# Altium schematic sheet FiltroRecuperador.SchDoc
size A4
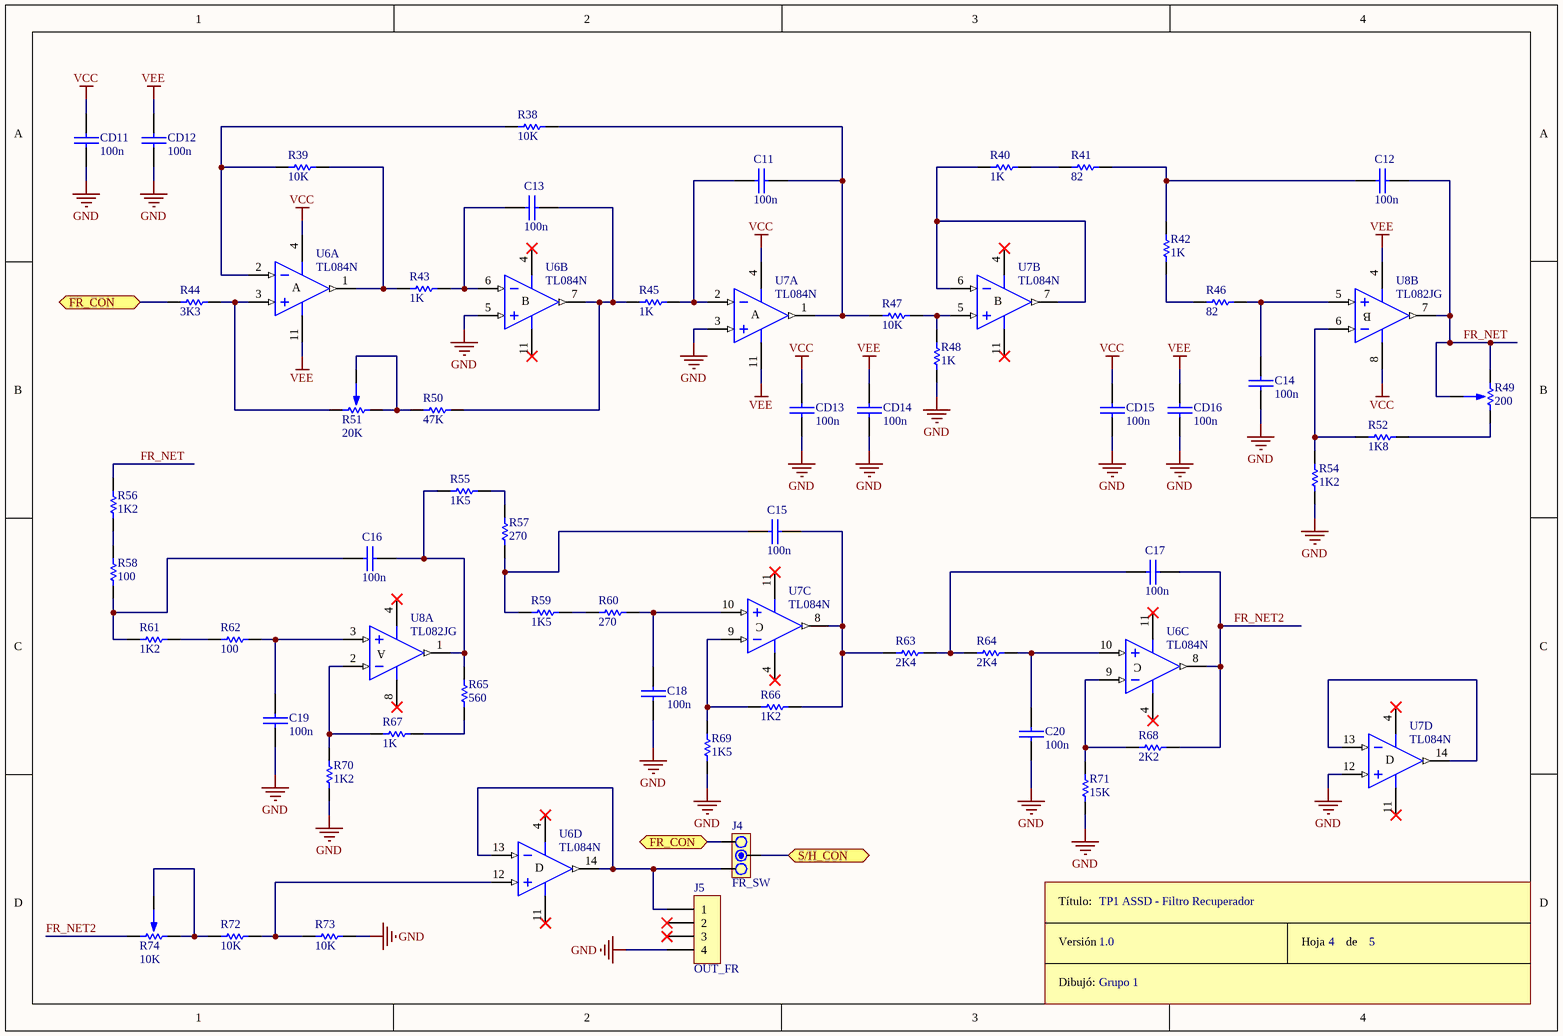
[diagram p0: FiltroRecuperador.SchDoc]

## Parts
C11  100n  [CAP100]
C12  100n  [CAP100]
C13  100n  [CAP100]
C14  100n  [CAP100]
C15  100n  [CAP100]
C16  100n  [CAP100]
C17  100n  [CAP100]
C18  100n  [CAP100]
C19  100n  [CAP100]
C20  100n  [CAP100]
CD11  100n  [CAP100]
CD12  100n  [CAP100]
CD13  100n  [CAP100]
CD14  100n  [CAP100]
CD15  100n  [CAP100]
CD16  100n  [CAP100]
J4  FR_SW  [JUMPER3]
J5  OUT_FR  [SIP4]
R38  10K  [RES400]
R39  10K  [RES400]
R40  1K  [RES400]
R41  82  [RES400]
R42  1K  [RES400]
R43  1K  [RES400]
R44  3K3  [RES400]
R45  1K  [RES400]
R46  82  [RES400]
R47  10K  [RES400]
R48  1K  [RES400]
R49  200  [PRESET V]
R50  47K  [RES400]
R51  20K  [PRESET V]
R52  1K8  [RES400]
R54  1K2  [RES400]
R55  1K5  [RES400]
R56  1K2  [RES400]
R57  270  [RES400]
R58  100  [RES400]
R59  1K5  [RES400]
R60  270  [RES400]
R61  1K2  [RES400]
R62  100  [RES400]
R63  2K4  [RES400]
R64  2K4  [RES400]
R65  560  [RES400]
R66  1K2  [RES400]
R67  1K  [RES400]
R68  2K2  [RES400]
R69  1K5  [RES400]
R70  1K2  [RES400]
R71  15K  [RES400]
R72  10K  [RES400]
R73  10K  [RES400]
R74  10K  [PRESET V]
ROT4  Rótulo  (value not drawn)
U6  TL084N  [N014]  (parts A,B,C,D of 4)
U7  TL084N  [N014]  (parts A,B,C,D of 4)
U8  TL082JG  [JG008]  (parts A,B of 2)

## Ports
FR_CON, S/H_CON

## Nets
GND: C14.2 C18.2 C19.1 C20.2 CD11.2 CD12.2 CD13.2 CD14.2 CD15.2 CD16.2 J5.4 R48.1 R54.1 R69.1 R70.1 R71.1 R73.1 U6.5(IN+) U7.3(IN+) U7.12(IN+)
VCC: CD11.1 CD13.1 CD15.1 U6.4(V+) U7.4(V+) U8.8(V+)
VEE: CD12.1 CD14.1 CD16.1 U6.11(V-) U7.11(V-) U8.4(V-)
FR_CON: J4.3 R44.1 ; port FR_CON
FR_NET: C12.2 R49.2 R49.3 R56.1 U8.7(OUT)
FR_NET2: C17.2 R68.2 R74.1 U6.8(OUT)
S/H_CON: J4.2 ; port S/H_CON
NetC11_1: C11.1 R45.2 U7.2(IN-)
NetC11_2: C11.2 R38.2 R47.1 U7.1(OUT)
NetC12_1: C12.1 R41.2 R42.2
NetC13_1: C13.1 R43.2 U6.6(IN-)
NetC13_2: C13.2 R45.1 R50.2 U6.7(OUT)
NetC14_1: C14.1 R46.2 U8.5(IN+)
NetC15_1: C15.1 R57.2 R59.1
NetC15_2: C15.2 R63.1 R66.2 U7.8(OUT)
NetC16_1: C16.1 R58.2 R61.1
NetC16_2: C16.2 R55.2 R65.2 U8.1(OUT)
NetC17_1: C17.1 R63.2 R64.1
NetC18_1: C18.1 R60.2 U7.10(IN+)
NetC19_2: C19.2 R62.2 U8.3(IN+)
NetC20_1: C20.1 R64.2 U6.10(IN+)
NetJ4_1: J4.1 J5.1 U6.13(IN-) U6.14(OUT)
NetR38_1: R38.1 R39.1 U6.2(IN-)
NetR39_2: R39.2 R43.1 U6.1(OUT)
NetR40_1: R40.1 R41.1
NetR40_2: R40.2 U7.6(IN-) U7.7(OUT)
NetR42_1: R42.1 R46.1
NetR44_2: R44.2 R51.1 U6.3(IN+)
NetR47_2: R47.2 R48.2 U7.5(IN+)
NetR49_1: R49.1 R52.2
NetR50_1: R50.1 R51.2 R51.3
NetR52_1: R52.1 R54.2 U8.6(IN-)
NetR55_1: R55.1 R57.1
NetR56_2: R56.2 R58.1
NetR59_2: R59.2 R60.1
NetR61_2: R61.2 R62.1
NetR65_1: R65.1 R67.2
NetR66_1: R66.1 R69.2 U7.9(IN-)
NetR67_1: R67.1 R70.2 U8.2(IN-)
NetR68_1: R68.1 R71.2 U6.9(IN-)
NetR72_1: R72.1 R74.2 R74.3
NetR72_2: R72.2 R73.2 U6.12(IN+)
NetU7_13: U7.13(IN-) U7.14(OUT)

Not connected (* = marked no-connect by the designer): J5 2* 3*

## Notes on the sheet
- TP1 ASSD - Filtro Recuperador
- 1.0
- Grupo 1
- 4
- 5
- (in symbol Rótulo) Título:; Versión; Hoja       de; Dibujó:
- (in symbol TL082JG, part A) A
- (in symbol TL082JG, part B) B
- (in symbol TL084N, part A) A
- (in symbol TL084N, part B) B
- (in symbol TL084N, part C) C
- (in symbol TL084N, part D) D

## Library data of the parts
C11-C20 CD11-CD16 = CAP
J4 = JUMPER3
J5 = CON4
R38-R48 R50 R52 R54-R73 = RES
R49 R51 R74 = PRESET
U6 U7 = TL084N: JFET-Input Operational Amplifier; Published: 16-Jan-2001; LatestRevisionDate: 04-Mar-2005; LatestRevisionNote: Stylized 3D Model Added.; DatasheetVersion: Feb-1999; PackageVersion: Oct-1995; PackageReference: N014; Publisher: Altium Limited; PackageDescription: DIP; 14 Leads; Row Spacing 7.62 mm; Pitch 2.54 mm; ComponentLink1Description: Manufacturer Link; ComponentLink1URL: http://www.ti.com/; ComponentLink2Description: Datasheet; ComponentLink2URL: http://www-s.ti.com/sc/ds/tl084.pdf
U8 = TL082JG: JFET-Input Operational Amplifier; Published: 16-Jan-2001; LatestRevisionDate: 04-Mar-2005; LatestRevisionNote: Stylized 3D Model Added.; DatasheetVersion: Feb-1999; PackageVersion: Jan-1995; PackageReference: JG008; Publisher: Altium Limited; PackageDescription: DIP; 8 Leads; Row Spacing 7.62 mm; Pitch 2.54 mm; ComponentLink1Description: Manufacturer Link; ComponentLink1URL: http://www.ti.com/; ComponentLink2Description: Datasheet; ComponentLink2URL: http://www-s.ti.com/sc/ds/tl082.pdf